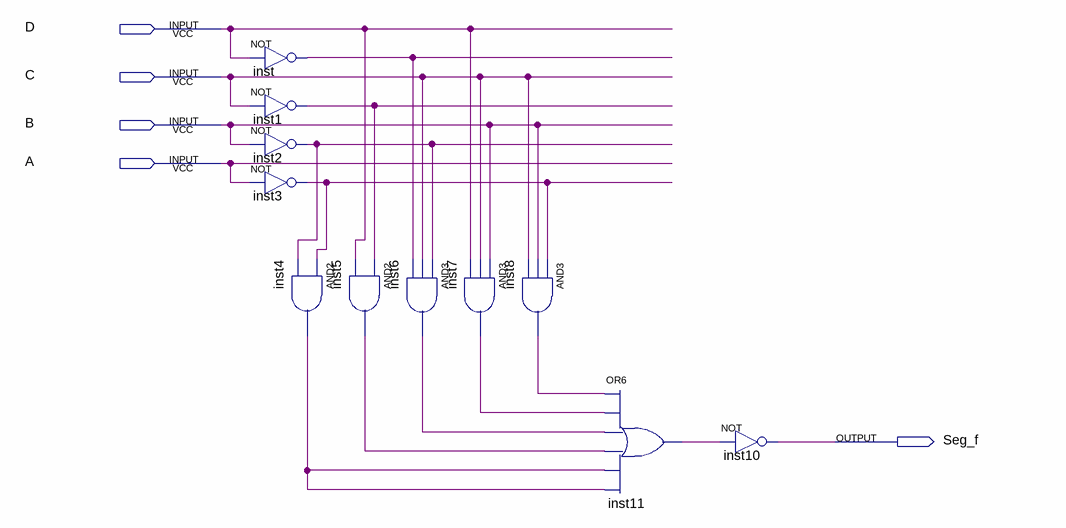
[diagram p0: schematic sheet]
// Quartus schematic Seg_f.bdf as structural Verilog: 11 symbols, 5 pins
module Seg_f (
  input  D,
  input  C,
  input  B,
  input  A,
  output Seg_f
);

  wire inst1_out, inst2_out, inst3_out, inst4_out, inst5_out, inst6_out, inst7_out, inst8_out, inst11_out,
       inst_out;

  not inst (inst_out, D);
  not inst1 (inst1_out, C);
  not inst2 (inst2_out, B);
  not inst3 (inst3_out, A);
  and inst4 (inst4_out, inst3_out, inst2_out);
  and inst5 (inst5_out, inst1_out, D);
  and inst6 (inst6_out, inst2_out, C, inst_out);
  and inst7 (inst7_out, B, C, D);
  and inst8 (inst8_out, inst3_out, B, C);
  or inst11 (inst11_out, inst8_out, inst7_out, inst6_out, inst5_out, inst4_out, inst4_out);
  not inst10 (Seg_f, inst11_out);
endmodule
